# EAGLE design leit-proto-1 (EAGLE 6.3)
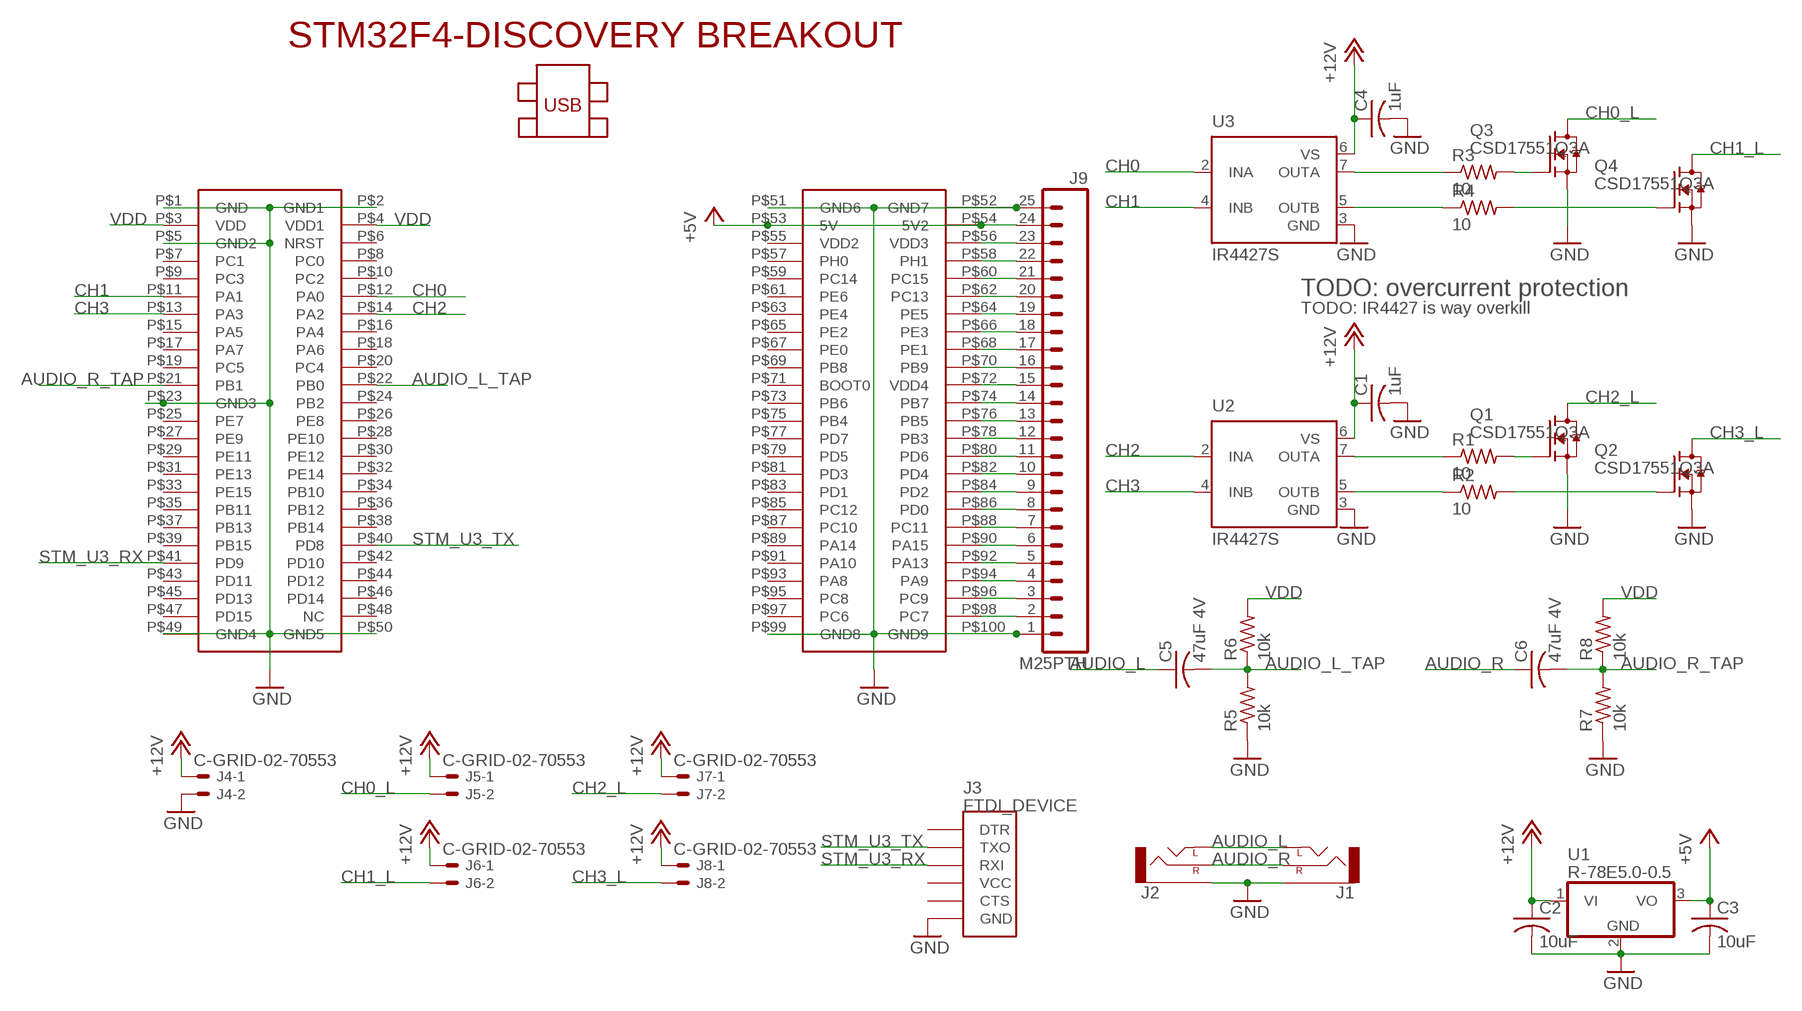
[diagram p0: schematic, sheet 1]

## Parts
C1  1uF  C-USC0603  [C0603]
C2  10uF  C-USC0805  [C0805]
C3  10uF  C-USC0805  [C0805]
C4  1uF  C-USC0603  [C0603]
C5  47uF 4V  C-USC0805  [C0805]
C6  47uF 4V  C-USC0805  [C0805]
J1  AUDIO-JACKPTH  [AUDIO-JACK]
J2  AUDIO-JACKPTH  [AUDIO-JACK]
J3  FTDI_DEVICE  [FTDI_DEVICE_SIDE]
J4  C-GRID-02-70553  [70553-02]
J5  C-GRID-02-70553  [70553-02]
J6  C-GRID-02-70553  [70553-02]
J7  C-GRID-02-70553  [70553-02]
J8  C-GRID-02-70553  [70553-02]
J9  M25PTH  [1X25]
MOD1  STM32F4-DISCOVERY  [STM32F4-DISCOVERY]
Q1  CSD17551Q3A  [SON3.3]
Q2  CSD17551Q3A  [SON3.3]
Q3  CSD17551Q3A  [SON3.3]
Q4  CSD17551Q3A  [SON3.3]
R1  10  R-US_R0603  [R0603]
R2  10  R-US_R0603  [R0603]
R3  10  R-US_R0603  [R0603]
R4  10  R-US_R0603  [R0603]
R5  10k  R-US_R0603  [R0603]
R6  10k  R-US_R0603  [R0603]
R7  10k  R-US_R0603  [R0603]
R8  10k  R-US_R0603  [R0603]
U1  R-78E5.0-0.5  7805TV  [TO220V]
U2  IR4427S  [SO08]
U3  IR4427S  [SO08]

## Nets
+5V: C3.1 J9.24 MOD1.P$53(5V) MOD1.P$54(5V2) U1.3(VO)
+12V: C1.1 C2.1 C4.1 J4.1 J5.1 J6.1 J7.1 J8.1 U1.1(VI) U2.6(VS) U3.6(VS)
AUDIO_L: C5.1 J1.TIP(LEFT) J2.TIP(LEFT)
AUDIO_L_TAP: C5.2 MOD1.P$22(PB0) R5.2 R6.1
AUDIO_R: C6.1 J1.RING(RIGHT) J2.RING(RIGHT)
AUDIO_R_TAP: C6.2 MOD1.P$21(PB1) R7.2 R8.1
CH0: MOD1.P$12(PA0) U3.2(INA)
CH0_L: J5.2 Q3.5(D) Q3.6(D) Q3.7(D) Q3.8(D)
CH1: MOD1.P$11(PA1) U3.4(INB)
CH1_L: J6.2 Q4.5(D) Q4.6(D) Q4.7(D) Q4.8(D)
CH2: MOD1.P$14(PA2) U2.2(INA)
CH2_L: J7.2 Q1.5(D) Q1.6(D) Q1.7(D) Q1.8(D)
CH3: MOD1.P$13(PA3) U2.4(INB)
CH3_L: J8.2 Q2.5(D) Q2.6(D) Q2.7(D) Q2.8(D)
GND: C1.2 C2.2 C3.2 C4.2 J1.SLEEVE J2.SLEEVE J3.P$6(GND) J4.2 J9.1 J9.25 MOD1.P$1(GND) MOD1.P$2(GND1) MOD1.P$5(GND2) MOD1.P$23(GND3) MOD1.P$49(GND4) MOD1.P$50(GND5) MOD1.P$51(GND6) MOD1.P$52(GND7) MOD1.P$99(GND8) MOD1.P$100(GND9) Q1.1(S) Q1.2(S) Q1.3(S) Q2.1(S) Q2.2(S) Q2.3(S) Q3.1(S) Q3.2(S) Q3.3(S) Q4.1(S) Q4.2(S) Q4.3(S) R5.1 R7.1 U1.2(GND) U2.3(GND) U3.3(GND)
N$1: R1.1 U2.7(OUTA)
N$2: Q1.4(G) R1.2
N$3: Q2.4(G) R2.2
N$4: R2.1 U2.5(OUTB)
N$5: R3.1 U3.7(OUTA)
N$6: Q3.4(G) R3.2
N$7: Q4.4(G) R4.2
N$8: R4.1 U3.5(OUTB)
N$9: J9.2 MOD1.P$98(PC7)
N$10: J9.3 MOD1.P$96(PC9)
N$11: J9.4 MOD1.P$94(PA9)
N$12: J9.5 MOD1.P$92(PA13)
N$13: J9.6 MOD1.P$90(PA15)
N$14: J9.7 MOD1.P$88(PC11)
N$15: J9.8 MOD1.P$86(PD0)
N$16: J9.9 MOD1.P$84(PD2)
N$17: J9.10 MOD1.P$82(PD4)
N$18: J9.11 MOD1.P$80(PD6)
N$19: J9.12 MOD1.P$78(PB3)
N$20: J9.13 MOD1.P$76(PB5)
N$21: J9.14 MOD1.P$74(PB7)
N$22: J9.15 MOD1.P$72(VDD4)
N$23: J9.16 MOD1.P$70(PB9)
N$24: J9.17 MOD1.P$68(PE1)
N$25: J9.18 MOD1.P$66(PE3)
N$26: J9.19 MOD1.P$64(PE5)
N$27: J9.20 MOD1.P$62(PC13)
N$28: J9.21 MOD1.P$60(PC15)
N$29: J9.22 MOD1.P$58(PH1)
N$30: J9.23 MOD1.P$56(VDD3)
STM_U3_RX: J3.P$3(RXI) MOD1.P$41(PD9)
STM_U3_TX: J3.P$2(TXO) MOD1.P$40(PD8)
VDD: MOD1.P$3(VDD) MOD1.P$4(VDD1) R6.2 R8.2
Unconnected: J3.P$1(DTR) J3.P$4(VCC) J3.P$5(CTS) MOD1.P$6(NRST) MOD1.P$7(PC1) MOD1.P$8(PC0) MOD1.P$9(PC3) MOD1.P$10(PC2) MOD1.P$15(PA5) MOD1.P$16(PA4) MOD1.P$17(PA7) MOD1.P$18(PA6) MOD1.P$19(PC5) MOD1.P$20(PC4) MOD1.P$24(PB2) MOD1.P$25(PE7) MOD1.P$26(PE8) MOD1.P$27(PE9) MOD1.P$28(PE10) MOD1.P$29(PE11) MOD1.P$30(PE12) MOD1.P$31(PE13) MOD1.P$32(PE14) MOD1.P$33(PE15) MOD1.P$34(PB10) MOD1.P$35(PB11) MOD1.P$36(PB12) MOD1.P$37(PB13) MOD1.P$38(PB14) MOD1.P$39(PB15) MOD1.P$42(PD10) MOD1.P$43(PD11) MOD1.P$44(PD12) MOD1.P$45(PD13) MOD1.P$46(PD14) MOD1.P$47(PD15) MOD1.P$48(NC) MOD1.P$55(VDD2) MOD1.P$57(PH0) MOD1.P$59(PC14) MOD1.P$61(PE6) MOD1.P$63(PE4) MOD1.P$65(PE2) MOD1.P$67(PE0) MOD1.P$69(PB8) MOD1.P$71(BOOT0) MOD1.P$73(PB6) MOD1.P$75(PB4) MOD1.P$77(PD7) MOD1.P$79(PD5) MOD1.P$81(PD3) MOD1.P$83(PD1) MOD1.P$85(PC12) MOD1.P$87(PC10) MOD1.P$89(PA14) MOD1.P$91(PA10) MOD1.P$93(PA8) MOD1.P$95(PC8) MOD1.P$97(PC6)

## Notes on the sheet
- TODO: overcurrent protection
- TODO: IR4427 is way overkill

## Library data of the parts
C1-C6 = rcl:C-US: CAPACITOR, American symbol
J1 J2 = SparkFun-Connectors:AUDIO-JACK: 3.5mm Audio Jack Simple 3.5mm common PCB mount audio jack. SKU: PRT-08032
J3 = SparkFun-Connectors:FTDI_DEVICE: Connector which mates to FTDI basic or FTDI cable.
J4-J8 = con-molex:C-GRID-02: CONNECTOR wire to board 2.54 mm (0.100") pitch header; OC_FARNELL: unknown; OC_NEWARK: unknown
J9 = SparkFun-Connectors:M25: 1x25 .1" header
MOD1 = STM32F4-DISCOVERY:STM32F4-DISCOVERY
Q1-Q4 = leitshow:CSD17551Q3A: CSD17551Q3A 30V, N-Channel NexFET Power MOSFET Texas Instruments (datasheet <http://www.ti.com/lit/gpn/csd17551q3a>)
R1-R8 = rcl:R-US_: RESISTOR, American symbol
U1 = linear:78*: Positive VOLTAGE REGULATOR Source: http://cache.national.com/ds/LM/LM78L05.pdf http://www.fairchildsemi.com/ds/LM/LM7805.pdf
U2 U3 = ir:IR4427: DUAL LOW SIDE DRIVER Source: ID4426.pdf; MF: INTERNATIONAL RECTIFIER(IR); MPN: IR4427STRPBF; OC_FARNELL: 8639094; OC_NEWARK: 63J7933

## Board
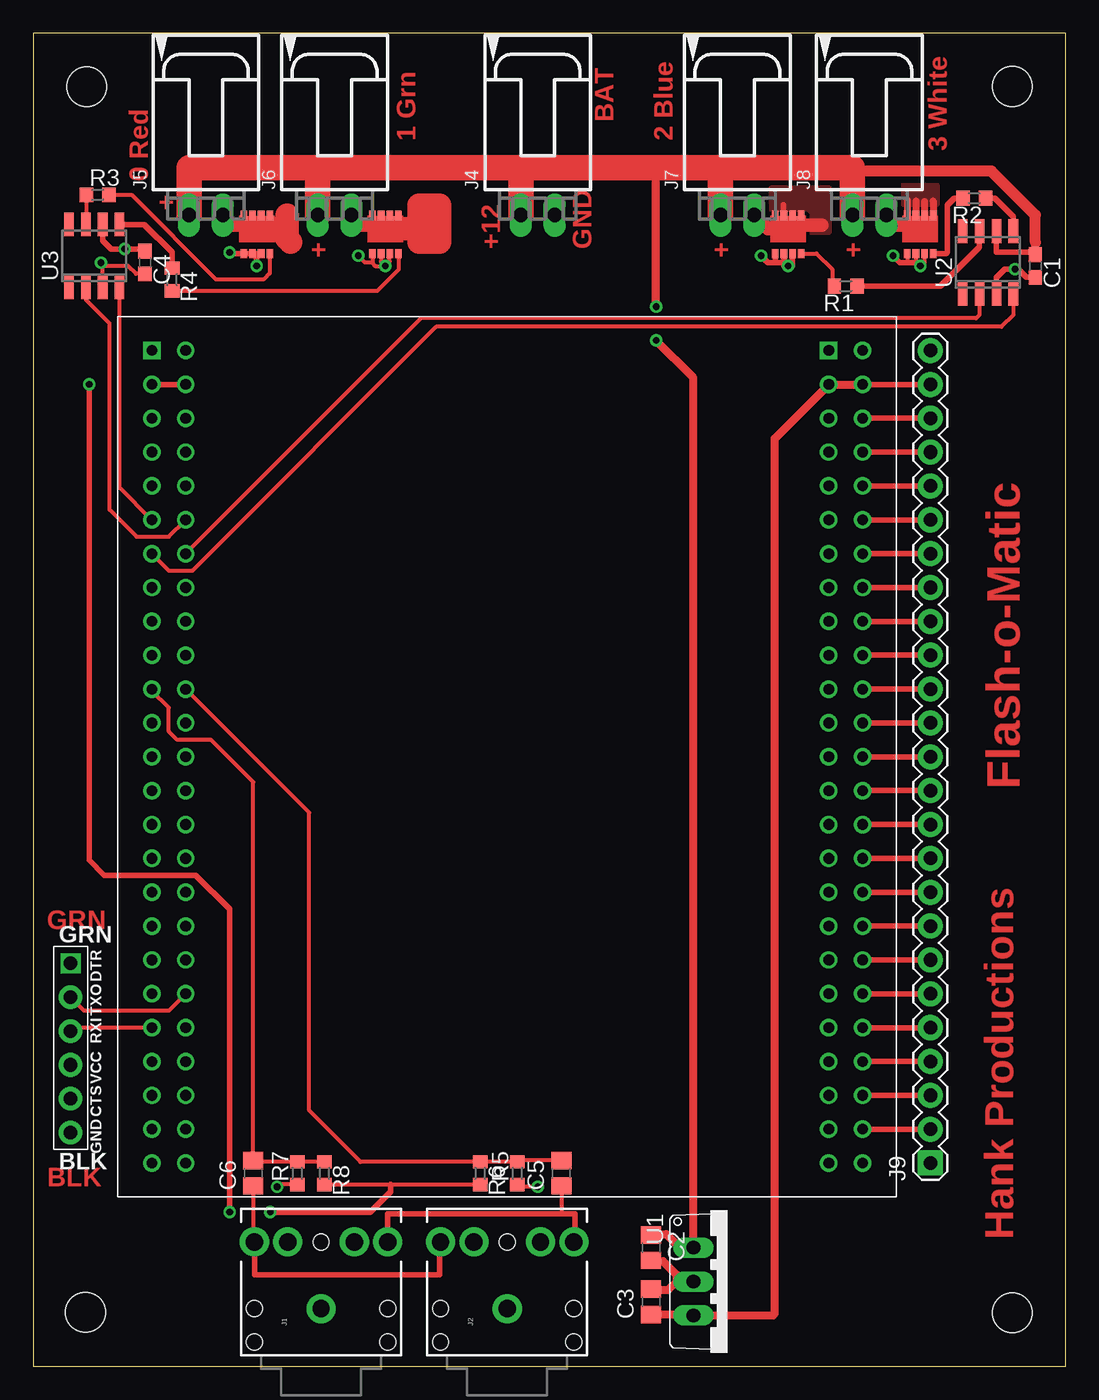
[diagram p1: board, top side]
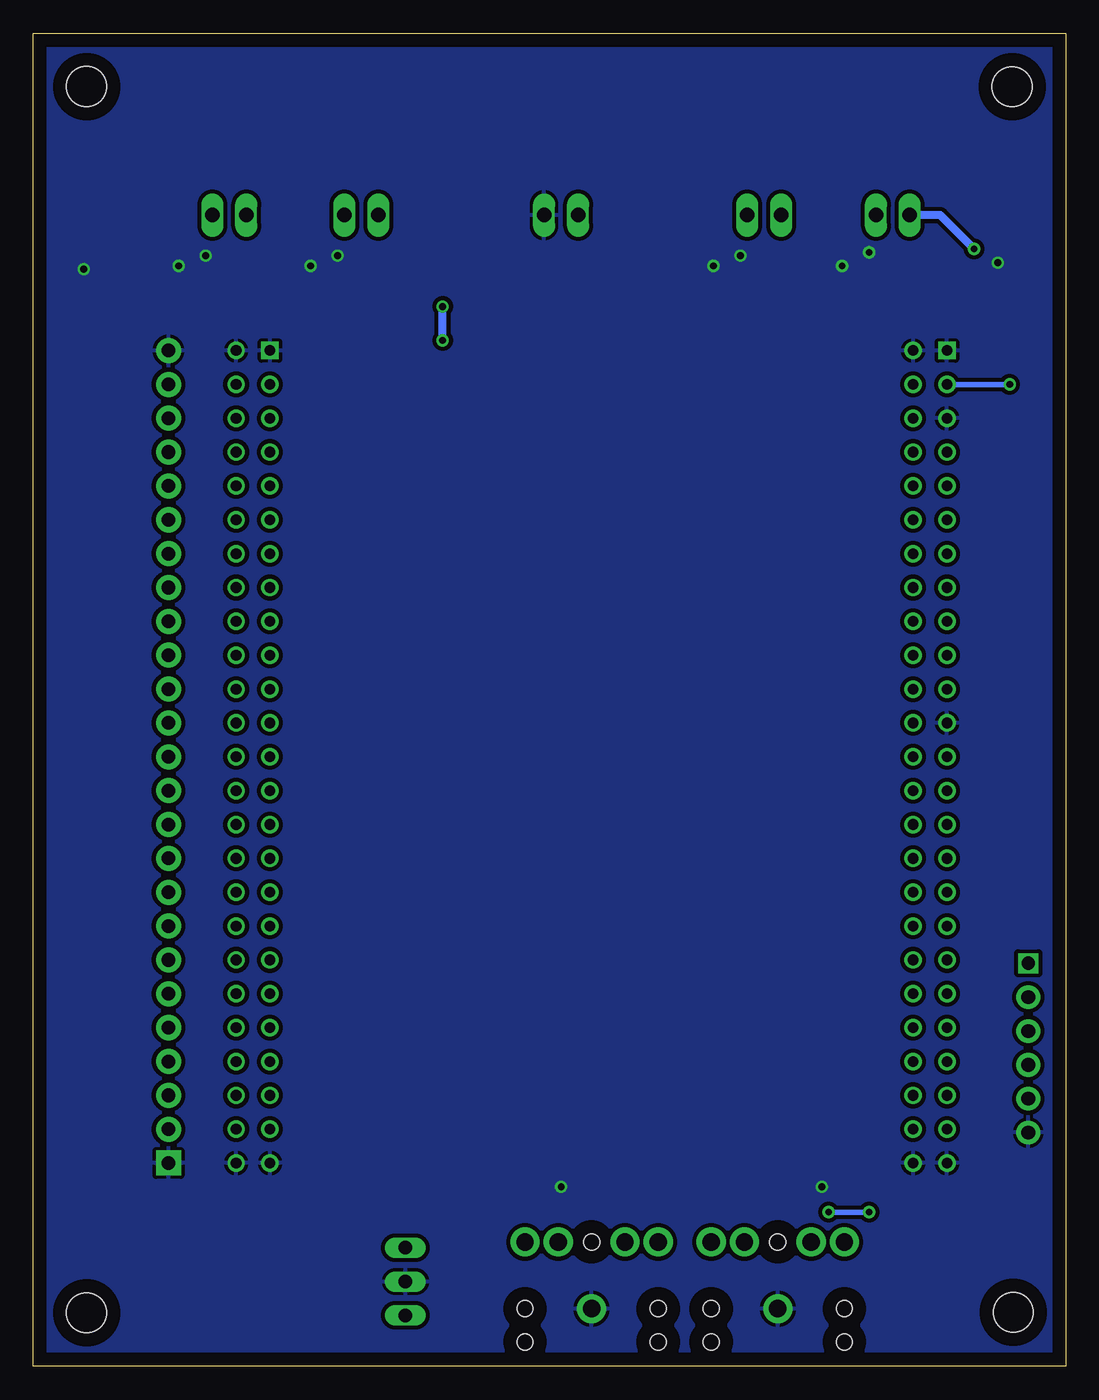
[diagram p2: board, bottom side, seen from below]

Size 77.45 x 100 mm. Coordinates in mm from the lower left corner, seen from the top.
Outline: 0,0 77.45,0 77.45,100 0,100 0,0
Copper layers (1*16): Top 0.035mm / dielectric 1.5mm / Bottom 0.035mm
Design rules "default *": minimum track width 10mil, minimum drill 24mil, track to track 6mil, track to pad 6mil, pad to pad 6mil, via to via 6mil, smd to smd 6mil, copper to edge 40mil, drill to drill 8mil, minimum pad ring 10mil, minimum via ring 8mil, stop-mask expansion 4mil, vias tented up to drill 0mil, thermal gap 10mil
Holes 3 mm at 3.92,4.05 73.45,4 4,96 73.45,96

### Footprints (pad centres in the part's own frame; a part is rotated, then mirrored left to right if it is on the bottom)
C0603 = smd 1.1 x 1: 1 -0.85,0; 2 0.85,0
C0805 = smd 1.3 x 1.5: 1 -0.95,0; 2 0.95,0
AUDIO-JACK = drill 1.3 pad 2.184: RING 5,5; RSH 5,2.5; SLEEVE 0,0; TIP 5,-5; TSH 5,-2.5 | hole 1.2: 0,5; -2.5,5; -2.5,-5; 0,-5; 5,0
FTDI_DEVICE_SIDE = drill 1 square: P$1 -6.35,0 | drill 1.016 pad 1.778: P$2 -3.81,0; P$3 -1.27,0; P$4 1.27,0; P$5 3.81,0; P$6 6.35,0
70553-02 = drill 1.092 long: 1 -1.27,-7.62; 2 1.27,-7.62
1X25 = drill 1.016 pad 1.88 square: 1 0,0 | drill 1.016 pad 1.88: 2 2.54,0; 3 5.08,0; 4 7.62,0; 5 10.16,0; 6 12.7,0; 7 15.24,0; 8 17.78,0; 9 20.32,0; 10 22.86,0; 11 25.4,0; 12 27.94,0; 13 30.48,0; 14 33.02,0; 15 35.56,0; 16 38.1,0; 17 40.64,0; 18 43.18,0; 19 45.72,0; 20 48.26,0; 21 50.8,0; 22 53.34,0; 23 55.88,0; 24 58.42,0; 25 60.96,0
STM32F4-DISCOVERY = drill 0.8 square: P$1 -27.94,30.48; P$51 22.86,30.48 | drill 0.8: P$2 -25.4,30.48; P$3 -27.94,27.94; P$4 -25.4,27.94; P$5 -27.94,25.4; P$6 -25.4,25.4; P$7 -27.94,22.86; P$8 -25.4,22.86; P$9 -27.94,20.32; P$10 -25.4,20.32; P$11 -27.94,17.78; P$12 -25.4,17.78; P$13 -27.94,15.24; P$14 -25.4,15.24; P$15 -27.94,12.7; P$16 -25.4,12.7; P$17 -27.94,10.16; P$18 -25.4,10.16; P$19 -27.94,7.62; P$20 -25.4,7.62; P$21 -27.94,5.08; P$22 -25.4,5.08; P$23 -27.94,2.54; P$24 -25.4,2.54; P$25 -27.94,0; P$26 -25.4,0; P$27 -27.94,-2.54; P$28 -25.4,-2.54; P$29 -27.94,-5.08; P$30 -25.4,-5.08; P$31 -27.94,-7.62; P$32 -25.4,-7.62; P$33 -27.94,-10.16; P$34 -25.4,-10.16; P$35 -27.94,-12.7; P$36 -25.4,-12.7; P$37 -27.94,-15.24; P$38 -25.4,-15.24; P$39 -27.94,-17.78; P$40 -25.4,-17.78; P$41 -27.94,-20.32; P$42 -25.4,-20.32; P$43 -27.94,-22.86; P$44 -25.4,-22.86; P$45 -27.94,-25.4; P$46 -25.4,-25.4; P$47 -27.94,-27.94; P$48 -25.4,-27.94; P$49 -27.94,-30.48; P$50 -25.4,-30.48; P$52 25.4,30.48; P$53 22.86,27.94; P$54 25.4,27.94; P$55 22.86,25.4; P$56 25.4,25.4; P$57 22.86,22.86; P$58 25.4,22.86; P$59 22.86,20.32; P$60 25.4,20.32; P$61 22.86,17.78; P$62 25.4,17.78; P$63 22.86,15.24; P$64 25.4,15.24; P$65 22.86,12.7; P$66 25.4,12.7; P$67 22.86,10.16; P$68 25.4,10.16; P$69 22.86,7.62; P$70 25.4,7.62; P$71 22.86,5.08; P$72 25.4,5.08; P$73 22.86,2.54; P$74 25.4,2.54; P$75 22.86,0; P$76 25.4,0; P$77 22.86,-2.54; P$78 25.4,-2.54; P$79 22.86,-5.08; P$80 25.4,-5.08; P$81 22.86,-7.62; P$82 25.4,-7.62; P$83 22.86,-10.16; P$84 25.4,-10.16; P$85 22.86,-12.7; P$86 25.4,-12.7; P$87 22.86,-15.24; P$88 25.4,-15.24; P$89 22.86,-17.78; P$90 25.4,-17.78; P$91 22.86,-20.32; P$92 25.4,-20.32; P$93 22.86,-22.86; P$94 25.4,-22.86; P$95 22.86,-25.4; P$96 25.4,-25.4; P$97 22.86,-27.94; P$98 25.4,-27.94; P$99 22.86,-30.48; P$100 25.4,-30.48
SON3.3 = smd 0.5 x 0.68: 1 -0.975,-1.62; 2 -0.325,-1.62; 3 0.325,-1.62; 4 0.975,-1.62; 5 0.975,1.25; 6 0.325,1.25; 7 -0.325,1.25; 8 -0.975,1.25
R0603 = smd 1 x 1.1: 1 -0.85,0; 2 0.85,0
TO220V = drill 1.016 long: 1 -2.54,-2.54; 2 0,-2.54; 3 2.54,-2.54
SO08 = smd 0.72 x 1.78: 1 -1.905,-2.35; 2 -0.635,-2.35; 3 0.635,-2.35; 4 1.905,-2.35; 5 1.905,2.35; 6 0.635,2.35; 7 -0.635,2.35; 8 -1.905,2.35

### Placement (x,y rotation side)
C1  75.18,82.55 270 top
C2  46.35,8.89 270 top
C3  46.35,4.83 90 top
C4  8.38,82.8 270 top
C5  39.62,14.48 90 top
C6  16.51,14.48 90 top
J1  21.59,4.32 90 top
J2  35.56,4.32 90 top
J3  2.79,23.88 270 top
J4  37.85,93.98 0 top
J5  12.95,93.98 0 top
J6  22.61,93.98 0 top
J7  52.83,93.98 0 top
J8  62.74,93.98 0 top
J9  67.31,15.24 90 top
MOD1  36.83,45.72 0 top
Q1  56.64,85.09 0 top
Q2  66.55,85.09 0 top
Q3  16.76,85.09 0 top
Q4  26.42,85.09 0 top
R1  60.96,81.03 180 top
R2  70.61,87.63 180 top
R3  4.83,87.88 0 top
R4  10.41,81.53 270 top
R5  36.32,14.48 90 top
R6  33.53,14.48 270 top
R7  19.81,14.48 90 top
R8  21.84,14.48 270 top
U1  52.07,6.35 270 top
U2  71.63,82.8 0 top
U3  4.57,83.31 0 top

### Tracks (layer width: path | path; a pad name or v marks a point on that pad's centre or on a via)
+5V
  Top 0.406: MOD1.P$54 J9.24
  Top 0.61: C3.1 49.46,3.88 U1.3 55.5,3.81 55.63,3.94 55.63,69.6 MOD1.P$53 MOD1.P$54
+12V  (via drill 0.51)
  Top 0.406: C4.1 8.22,83.82 v6.86,83.82 5.84,83.82 5.21,84.45 U3.6 | U2.6 72.26,83.57 75.18,83.57
  Top 0.61: C1.1 75.18,83.57 75.18,84.33 | v46.74,76.96 49.53,74.17 U1.1 48.51,8.89 47.5,9.91 46.42,9.91 C2.1 | v46.74,79.5 46.74,89.92
  Top 0.813: 75.18,84.33 75.18,86.36 71.88,89.66 61.72,89.66 61.47,89.92
  Top 1.93: J4.1 36.58,89.92 | 36.58,89.92 21.34,89.92 | 21.34,89.92 11.68,89.92 J5.1 | J8.1 61.47,89.92 51.56,89.92 | 51.56,89.92 46.74,89.92 36.58,89.92 | J7.1 51.56,89.92 | J6.1 21.34,89.92
  Bottom 0.61: v6.86,83.82 9.4,86.36 J5.1 | v46.74,76.96 v46.74,79.5
AUDIO_L
  Top 0.305: C5.1 39.62,11.56 39.75,11.43
  Top 0.406: J1.TIP 26.59,11.43 39.75,11.43 40.64,11.43 40.64,9.32 J2.TIP
AUDIO_L_TAP
  Top 0.305: C5.2 36.42,15.43 R5.2 R6.1 24.55,15.33 20.7,19.18 20.7,41.53 MOD1.P$22
AUDIO_R
  Top 0.305: C6.1 16.51,9.4 J1.RING
  Top 0.406: J1.RING 16.59,6.86 30.48,6.86 30.48,9.32 J2.RING
AUDIO_R_TAP
  Top 0.305: R8.1 R7.2 16.61,15.33 C6.2 16.51,43.81 13.34,46.99 10.79,46.99 10.16,47.62 10.16,49.4 8.89,50.67 MOD1.P$21
CH0
  Top 0.305: MOD1.P$12 10.16,62.23 7.75,62.23 5.71,64.26 5.71,78.23 3.94,80.01 U3.2
CH0_L
  Top 0.406: 15.77,86.36 Q3.8 15.79,85.81 16,85.6 16.44,85.6 | 16.44,85.6 17.09,85.6 | 17.09,85.6 17.53,85.6 17.74,85.6 Q3.5 | Q3.6 17.09,85.6 | Q3.7 16.44,85.6
  Top 1.016: J5.2 14.99,85.6 16,85.6
  Top 1.27: 17.53,85.6 18.29,85.6 18.54,85.34
  Top 1.778: 18.54,85.34 19.05,84.58 | 19.05,84.58 19.3,84.33 | 19.05,84.58 19.05,86.36
CH1
  Top 0.305: MOD1.P$11 6.48,65.91 U3.4
CH1_L
  Top 0.305: 25.91,85.6 25.65,85.6 25.44,85.81 Q4.8 25.44,85.64 25.4,85.6 | Q4.7 26.09,85.78 25.91,85.6 | Q4.6 26.74,85.92 26.42,85.6 | 26.42,85.6 25.91,85.6 | Q4.5 27.39,85.81 27.18,85.6 | 27.18,85.6 26.42,85.6 | 28.96,87.12 28.96,85.85 28.7,85.6 27.18,85.6
  Top 1.016: 25.4,85.6 24.64,85.6 J6.2
  Top 1.778: 28.96,87.12 28.96,84.33 30.48,84.33 30.48,87.12 28.96,87.12
CH2
  Top 0.305: U2.2 70.99,78.87 70.74,78.61 29.08,78.61 MOD1.P$14
CH2_L
  Top 0.254: 56.3,86.11 56.3,86.28 56.39,86.36 56.34,86.36 Q1.7
  Top 0.305: Q1.8 55.63,86.3 55.63,85.34 | Q1.7 56.39,86.27 56.39,85.09 56.13,85.34 55.88,85.34 | Q1.6 56.9,86.27 56.9,85.34 | Q1.5 57.66,86.3 57.66,85.34 57.4,85.34
  Top 0.406: 56.29,87.15 56.3,86.11
  Top 1.016: J7.2 55.12,85.34 55.63,85.34 55.88,85.34 56.9,85.34 57.4,85.34 | 57.91,85.6 59.18,85.6
  pour Top (isolate 0.305): 55.37,88.39 59.69,88.39 59.69,85.09 55.37,85.09
CH3
  Top 0.305: U2.4 73.53,78.87 72.64,77.98 30.23,77.98 11.94,59.69 10.16,59.69 MOD1.P$13
CH3_L
  Top 0.254: Q2.8 65.57,85.64 65.53,85.6 | Q2.7 66.22,85.67 66.29,85.6 | Q2.6 66.87,85.67 66.8,85.6
  Top 0.406: Q2.5 67.52,85.6 66.8,85.6 66.29,85.6 65.53,85.6
  Top 0.508: 65.57,87.53 65.57,86.15 Q2.8 | 66.23,87.42 66.23,86.05 | 66.87,87.38 66.88,86.01 | 67.52,87.43 67.52,86.06
  Top 1.016: 65.53,85.6 64.77,85.6 J8.2
  pour Top (isolate 0.305): 65.28,88.65 67.82,88.65 67.82,87.12 65.28,87.12
GND  (via drill 0.51)
  Top 0.305: v26.42,82.55 26.74,82.88 Q4.3 | Q4.2 26.09,82.88 v26.42,82.55 | Q4.1 25.44,82.84 25.4,82.8 | 25.4,82.8 24.89,82.8 v24.38,83.31 | 25.4,82.8 25.65,82.55 v26.42,82.55 | U3.3 5.21,82.68 v5.08,82.8 5.33,82.55 7.11,82.55 7.71,81.95 C4.2 | Q2.3 66.87,82.88 66.8,82.8 v66.55,82.55 66.22,82.88 Q2.2 | Q2.1 65.57,82.84 65.53,82.8 | R7.1 18.45,13.63 v18.29,13.46 | v37.85,13.46 36.58,13.46 36.45,13.59 36.36,13.59 R5.1
  Top 0.406: Q3.1 Q3.2 16.76,83.47 | 16.76,83.47 Q3.3 | v16.76,82.55 16.76,83.47 | v14.73,83.57 14.82,83.48 15.94,83.48 | Q1.1 55.67,82.8 | Q1.2 56.32,82.55 v56.64,82.55 56.97,82.55 Q1.3 | 55.67,82.8 55.12,82.8 v54.61,83.31 | 55.67,82.8 56.13,82.8 | v64.52,83.31 65.02,82.8 65.53,82.8 66.8,82.8 | C1.2 74.51,81.7 73.91,82.3 v73.66,82.3 72.9,82.3 72.26,81.66 U2.3
  Top 0.61: C3.2 46.42,5.71 47.62,5.71 48.26,6.35 U1.2 48.39,6.35 48.26,6.48 48.26,6.86 47.24,7.87 46.42,7.87 C2.2
  pour Bottom (isolate 0.305): 0.25,100.08 77.47,100.08 77.47,0 0.25,0
N$1
  Top 0.406: U2.7 70.99,83.95 68.07,81.03 R1.1
N$2
  Top 0.305: Q1.4 58.77,83.47 59.94,82.3 59.94,81.53 60.2,81.28 60.2,81.11 R1.2
N$3
  Top 0.406: Q2.4 68.48,83.47 68.58,83.57 68.58,87.12 69.09,87.63 R2.2
N$4
  Top 0.406: U2.5 73.53,86.23 72.14,87.63 R2.1
N$5
  Top 0.305: R3.1 3.98,85.66 U3.7
N$6
  Top 0.305: R3.2 7.37,87.88 13.72,81.53 17.27,81.53 17.74,82 Q3.4
N$7
  Top 0.305: R4.2 25.82,80.68 27.39,82.25 Q4.4
N$8
  Top 0.406: U3.5 8.32,85.66 10.41,83.57 R4.1
N$9
  Top 0.406: J9.2 MOD1.P$98
N$10
  Top 0.406: MOD1.P$96 J9.3
N$11
  Top 0.406: MOD1.P$94 J9.4
N$12
  Top 0.406: J9.5 MOD1.P$92
N$13
  Top 0.406: MOD1.P$90 J9.6
N$14
  Top 0.406: J9.7 MOD1.P$88
N$15
  Top 0.406: MOD1.P$86 J9.8
N$16
  Top 0.406: J9.9 MOD1.P$84
N$17
  Top 0.406: MOD1.P$82 J9.10
N$18
  Top 0.406: J9.11 MOD1.P$80
N$19
  Top 0.406: MOD1.P$78 J9.12
N$20
  Top 0.406: J9.13 MOD1.P$76
N$21
  Top 0.406: MOD1.P$74 J9.14
N$22
  Top 0.406: MOD1.P$72 J9.15
N$23
  Top 0.406: J9.16 MOD1.P$70
N$24
  Top 0.406: MOD1.P$68 J9.17
N$25
  Top 0.406: J9.18 MOD1.P$66
N$26
  Top 0.406: MOD1.P$64 J9.19
N$27
  Top 0.406: J9.20 MOD1.P$62
N$28
  Top 0.406: MOD1.P$60 J9.21
N$29
  Top 0.406: MOD1.P$58 J9.22
N$30
  Top 0.406: MOD1.P$56 J9.23
N$32
  Top 1.778: 27.43,85.34 29.46,85.34
STM_U3_RX
  Top 0.305: MOD1.P$41 3.05,25.4 J3.P$3
STM_U3_TX
  Top 0.305: MOD1.P$40 10.16,26.67 3.81,26.67 J3.P$2
VDD  (via drill 0.51)
  Top 0.305: R8.2 26.8,13.63 R6.2
  Top 0.406: MOD1.P$3 MOD1.P$4 | v4.19,73.66 4.19,37.97 5.33,36.83 12.19,36.83 14.73,34.29 v14.73,11.56 | v17.78,11.56 25.27,11.56 26.8,13.08 26.8,13.63
  Bottom 0.406: v4.19,73.66 MOD1.P$3 | v14.73,11.56 v17.78,11.56

### Text on the board
Top: BAT | 1 Grn | 2 Blue | 3 White | 0 Red | + | +12 | GND | + | + | + | Flash-o-Matic | GRN | BLK | Hank Productions